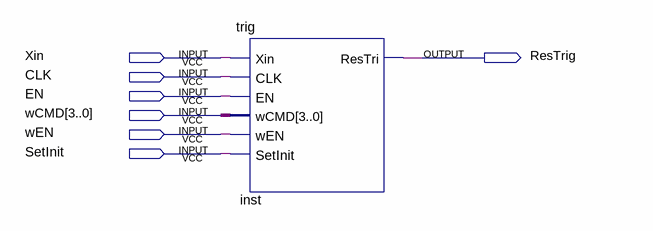
[diagram p0: schematic sheet]
// Quartus schematic TMPTOP.bdf as structural Verilog: 1 symbols, 7 pins
module TMPTOP (
  input  Xin,
  input  CLK,
  input  EN,
  input  [3:0] wCMD,
  input  wEN,
  input  SetInit,
  output ResTrig
);

  trig inst (.Xin(Xin), .CLK(CLK), .EN(EN), .wCMD(wCMD), .wEN(wEN), .SetInit(SetInit), .ResTri(ResTrig));
endmodule
